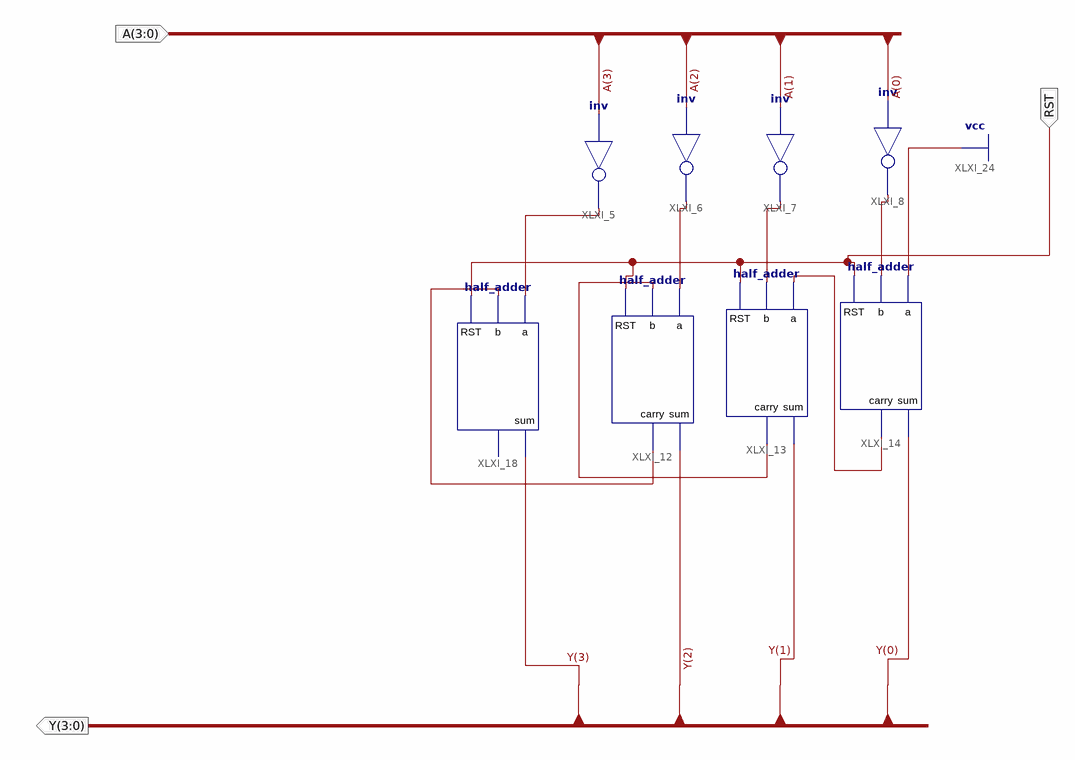
[diagram p0: schematic sheet 1]
// Xilinx ISE schematic compliment_2s4.sch (artix7) as structural Verilog: 8 symbols, 3 ports
module compliment_2s4 (
  input  [3:0] A,
  input  RST,
  output [3:0] Y
);

  wire XLXN_2, XLXN_3, XLXN_4, XLXN_7, XLXN_8, XLXN_41, XLXN_105;

  not XLXI_5 (XLXN_41, A[3]);
  not XLXI_6 (XLXN_4, A[2]);
  not XLXI_7 (XLXN_3, A[1]);
  not XLXI_8 (XLXN_2, A[0]);
  half_adder XLXI_12 (.a(XLXN_4), .b(XLXN_7), .carry(XLXN_105), .RST(RST), .sum(Y[2]));
  half_adder XLXI_13 (.a(XLXN_8), .b(XLXN_3), .carry(XLXN_7), .RST(RST), .sum(Y[1]));
  half_adder XLXI_14 (.a(1'b1), .b(XLXN_2), .carry(XLXN_8), .RST(RST), .sum(Y[0]));
  half_adder XLXI_18 (.a(XLXN_41), .b(XLXN_105), .RST(RST), .sum(Y[3]));  // open: carry
endmodule
